# Altium project ball_dropper_rev2.PrjPcb
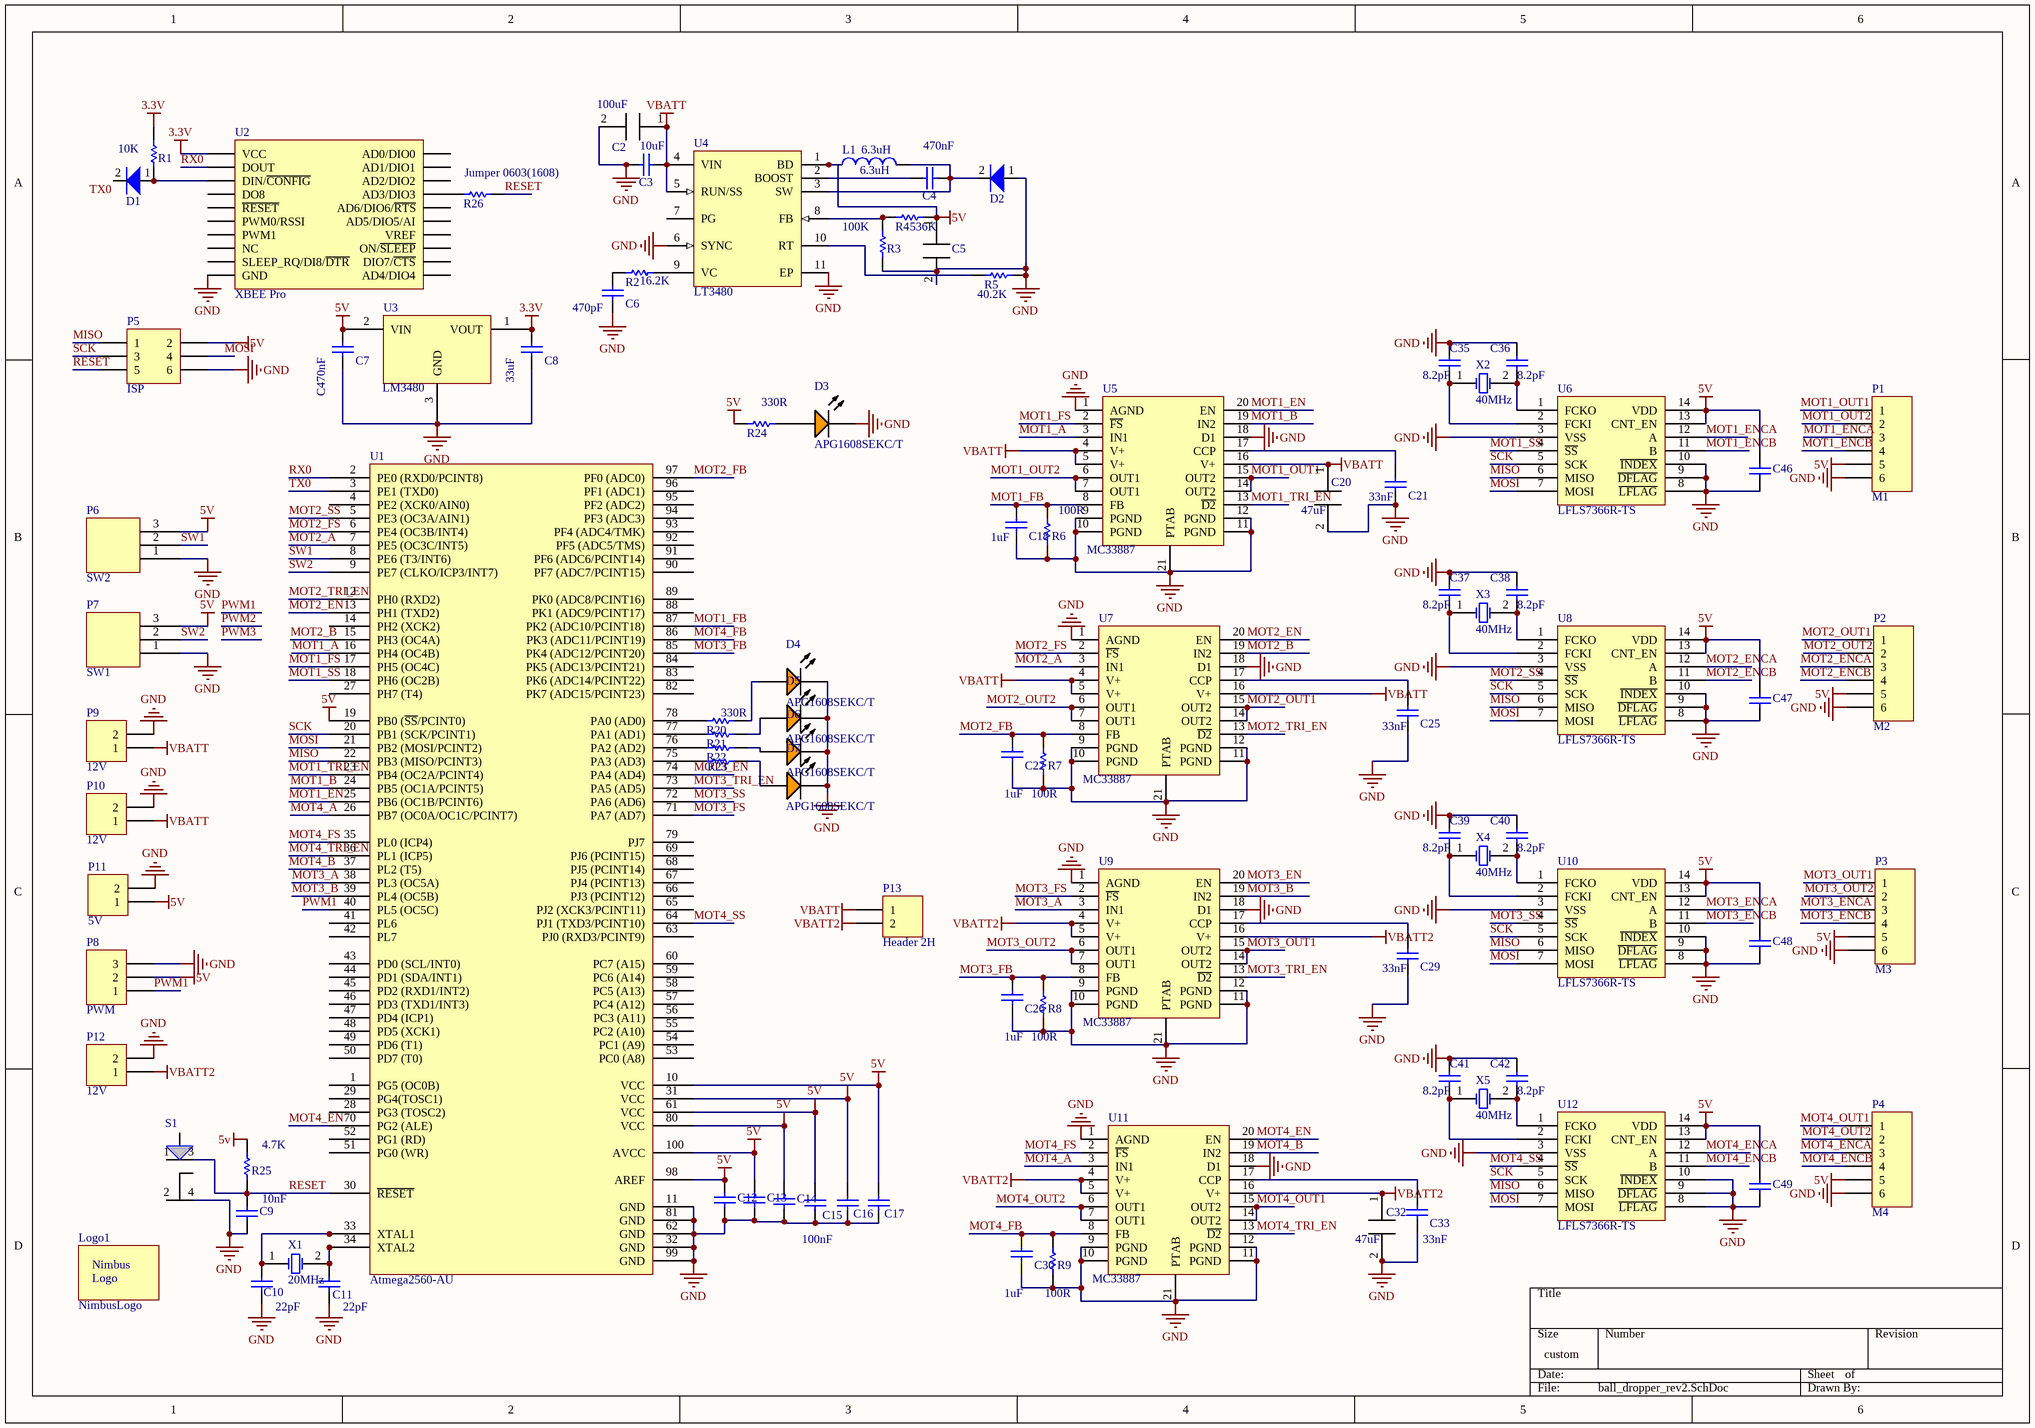
[diagram p0: ball_dropper_rev2.SchDoc]
1 sheet, 94 parts. Net scope: global (net labels, ports and power ports of the same name join across sheets).
Board file: ball_dropper_rev2.PcbDoc

## Sheet ball_dropper_rev2.SchDoc: Fire Ball Dropper Control Board Rev2
size 381 x 266 mm; Date: 11/7/14

### Parts
C2  100uF  [TantalumCap7343]
C3  10uF  [CAPC0603(1608)100_M]
C4  470nF  [CAPC0603(1608)100_N]
C5  47uF  [TantalumCap7343]  (value not drawn)
C6  470pF  [CAPC0603(1608)100_N]
C7  C470nF  [CAPC0603(1608)100_N]
C8  33uF  [CAPC1206(3216)190_M]
C9  10nF  [CAPC0603(1608)100_M]
C10  22pF  [CAPC0603(1608)100_M]
C11  22pF  [CAPC0603(1608)100_M]
C12  100nF  [CAPC0603(1608)100_N]  (value not drawn)
C13  100nF  [CAPC0603(1608)100_N]  (value not drawn)
C14  100nF  [CAPC0603(1608)100_N]  (value not drawn)
C15  100nF  [CAPC0603(1608)100_N]  (value not drawn)
C16  100nF  [CAPC0603(1608)100_N]  (value not drawn)
C17  100nF  [CAPC0603(1608)100_N]
C18  1uF  [CAPC0603(1608)100_N]
C20  47uF  [TantalumCap7343]
C21  33nF  [CAPC0603(1608)100_N]
C22  1uF  [CAPC0603(1608)100_N]
C25  33nF  [CAPC0603(1608)100_N]
C26  1uF  [CAPC0603(1608)100_N]
C29  33nF  [CAPC0603(1608)100_N]
C30  1uF  [CAPC0603(1608)100_N]
C32  47uF  [TantalumCap7343]
C33  33nF  [CAPC0603(1608)100_N]
C35  8.2pF  [CAPC0603(1608)100_N]
C36  8.2pF  [CAPC0603(1608)100_N]
C37  8.2pF  [CAPC0603(1608)100_N]
C38  8.2pF  [CAPC0603(1608)100_N]
C39  8.2pF  [CAPC0603(1608)100_N]
C40  8.2pF  [CAPC0603(1608)100_N]
C41  8.2pF  [CAPC0603(1608)100_N]
C42  8.2pF  [CAPC0603(1608)100_N]
C46  100nF  [CAPC0603(1608)100_N]  (value not drawn)
C47  100nF  [CAPC0603(1608)100_N]  (value not drawn)
C48  100nF  [CAPC0603(1608)100_N]  (value not drawn)
C49  100nF  [CAPC0603(1608)100_N]  (value not drawn)
D1  diode_MBRA210LT3G  [C1206]  (value not drawn)
D2  diode_B340A  [diode_B340A]  (value not drawn)
D3  APG1608SEKC/T  [KING-LED0603-25-ORANGE_V]
D4  APG1608SEKC/T  [KING-LED0603-25-ORANGE_V]
D5  APG1608SEKC/T  [KING-LED0603-25-ORANGE_V]
D6  APG1608SEKC/T  [KING-LED0603-25-ORANGE_V]
D7  APG1608SEKC/T  [KING-LED0603-25-ORANGE_V]
L1  6.3uH  [TYS6045]
Logo1  NimbusLogo  [NIMBUS Logo]
P1  M1  [DF3A-6P-2DS]
P2  M2  [DF3A-6P-2DS]
P3  M3  [DF3A-6P-2DS]
P4  M4  [DF3A-6P-2DS]
P5  ISP  [HDR2X3]
P6  SW2  [DF3A-3P-2DS]
P7  SW1  [DF3A-3P-2DS]
P8  PWM  [HDR1X3]
P9  12V  [DF3A-2P-2DS]
P10  12V  [DF3A-2P-2DS]
P11  5V  [DF3A-2P-2DS]
P12  12V  [DF3A-2P-2DS]
P13  Header 2H  [HDR1X2H]
R1  10K  [RESC0603(1608)_N]
R2  16.2K  [RESC0603(1608)_N]
R3  100K  [RESC0603(1608)_N]
R4  536K  [RESC0603(1608)_M]
R5  40.2K  [RESC0603(1608)_M]
R6  100R  [RESC0603(1608)_N]
R7  100R  [RESC0603(1608)_N]
R8  100R  [RESC0603(1608)_N]
R9  100R  [RESC0603(1608)_N]
R20  330R  [RESC0603(1608)_N]
R21  330R  [RESC0603(1608)_N]  (value not drawn)
R22  330R  [RESC0603(1608)_N]  (value not drawn)
R23  330R  [RESC0603(1608)_N]  (value not drawn)
R24  330R  [RESC0603(1608)_N]
R25  4.7K  [RESC0603(1608)_N]
R26  Jumper 0603(1608)  [RESC0603(1608)_N]
S1  TactileSwitch  [TactileSwitch]  (value not drawn)
U1  Atmega2560-AU  [TSQFP50P1600X1600X160-100N]
U2  XBEE Pro  [XBEE PRO]
U3  LM3480  [LM3480]
U4  LT3480  [LT-MSE-10-EDP_L]
U5  MC33887  [MC33887]
U6  LFLS7366R-TS  [TSOP127P600X135-14N]
U7  MC33887  [MC33887]
U8  LFLS7366R-TS  [TSOP127P600X135-14N]
U9  MC33887  [MC33887]
U10  LFLS7366R-TS  [TSOP127P600X135-14N]
U11  MC33887  [MC33887]
U12  LFLS7366R-TS  [TSOP127P600X135-14N]
X1  20MHz  [xtal4]
X2  40MHz  [xtal4]
X3  40MHz  [xtal4]
X4  40MHz  [xtal4]
X5  40MHz  [xtal4]

### Nets
3.3V: C8.2 R1.2 U2.1(VCC) U3.1(VOUT)
5V: C5.1(VCC) C7.2 C12.2 C13.2 C14.2 C15.1 C16.2 C17.2 C46.2 C47.2 C48.2 C49.2 L1.1 P1.5 P2.5 P3.5 P4.5 P5.2 P6.3 P7.3 P8.2 P11.1 R4.2 R24.1 R25.2 U1.10(VCC) U1.19(PB0_(~{SS}/PCINT0)) U1.31(VCC) U1.61(VCC) U1.80(VCC) U1.98(AREF) U1.100(AVCC) U3.2(VIN) U4.1(BD) U6.13(CNT_EN) U6.14(VDD) U8.13(CNT_EN) U8.14(VDD) U10.13(CNT_EN) U10.14(VDD) U12.13(CNT_EN) U12.14(VDD)
GND: C2.2(GND) C3.1 C5.2(GND) C6.1 C7.1 C8.1 C9.1 C10.1 C11.1 C12.1 C13.1 C14.1 C15.2 C16.1 C17.1 C18.1 C20.2(GND) C21.1 C22.1 C25.1 C26.1 C29.1 C30.1 C32.2(GND) C33.1 C35.2 C36.2 C37.2 C38.2 C39.2 C40.2 C41.2 C42.2 C46.1 C47.1 C48.1 C49.1 D2.1 D3.2(K) D4.2(K) D5.2(K) D6.2(K) D7.2(K) P1.6 P2.6 P3.6 P4.6 P5.6 P6.1 P7.1 P8.3 P9.2 P10.2 P11.2 P12.2 R3.1 R5.2 R6.1 R7.1 R8.1 R9.1 S1.4(GND) U1.11(GND) U1.32(GND) U1.62(GND) U1.81(GND) U1.99(GND) U2.10(GND) U3.3(GND) U4.6(SYNC) U4.11(EP) U5.1(AGND) U5.9(PGND) U5.10(PGND) U5.11(PGND) U5.12(PGND) U5.18(D1) U5.21(PTAB) U6.3(VSS) U6.8(~{LFLAG}) U6.9(~{DFLAG}) U6.10(~{INDEX}) U7.1(AGND) U7.9(PGND) U7.10(PGND) U7.11(PGND) U7.12(PGND) U7.18(D1) U7.21(PTAB) U8.3(VSS) U8.8(~{LFLAG}) U8.9(~{DFLAG}) U8.10(~{INDEX}) U9.1(AGND) U9.9(PGND) U9.10(PGND) U9.11(PGND) U9.12(PGND) U9.18(D1) U9.21(PTAB) U10.3(VSS) U10.8(~{LFLAG}) U10.9(~{DFLAG}) U10.10(~{INDEX}) U11.1(AGND) U11.9(PGND) U11.10(PGND) U11.11(PGND) U11.12(PGND) U11.18(D1) U11.21(PTAB) U12.3(VSS) U12.8(~{LFLAG}) U12.9(~{DFLAG}) U12.10(~{INDEX})
VBATT: C2.1(VCC) C3.2 C20.1(VCC) P9.1 P10.1 P13.1 U4.4(VIN) U4.5(RUN/SS) U5.4(V+) U5.5(V+) U5.16(V+) U7.4(V+) U7.5(V+) U7.16(V+)
VBATT2: C32.1(VCC) P12.1 P13.2 U9.4(V+) U9.5(V+) U9.16(V+) U11.4(V+) U11.5(V+) U11.16(V+)
MISO: P5.1 U1.22(PB3_(MISO/PCINT3)) U6.6(MISO) U8.6(MISO) U10.6(MISO) U12.6(MISO)
MOSI: P5.4 U1.21(PB2_(MOSI/PCINT2)) U6.7(MOSI) U8.7(MOSI) U10.7(MOSI) U12.7(MOSI)
MOT1_A: U1.16(PH4_(OC4B)) U5.3(IN1)
MOT1_B: U1.24(PB5_(OC1A/PCINT5)) U5.19(IN2)
MOT1_EN: U1.25(PB6_(OC1B/PCINT6)) U5.20(EN)
MOT1_ENCA: P1.3 U6.12(A)
MOT1_ENCB: P1.4 U6.11(B)
MOT1_FB: C18.2 R6.2 U1.87(PK2_(ADC10/PCINT18)) U5.8(FB)
MOT1_FS: U1.17(PH5_(OC4C)) U5.2(~{FS})
MOT1_OUT1: P1.1 U5.14(OUT2) U5.15(OUT2)
MOT1_OUT2: P1.2 U5.6(OUT1) U5.7(OUT1)
MOT1_SS: U1.18(PH6_(OC2B)) U6.4(~{SS})
MOT1_TRI_EN: U1.23(PB4_(OC2A/PCINT4)) U5.13(~{D2})
MOT2_A: U1.7(PE5_(OC3C/INT5)) U7.3(IN1)
MOT2_B: U1.15(PH3_(OC4A)) U7.19(IN2)
MOT2_EN: U1.13(PH1_(TXD2)) U7.20(EN)
MOT2_ENCA: P2.3 U8.12(A)
MOT2_ENCB: P2.4 U8.11(B)
MOT2_FB: C22.2 R7.2 U1.97(PF0_(ADC0)) U7.8(FB)
MOT2_FS: U1.6(PE4_(OC3B/INT4)) U7.2(~{FS})
MOT2_OUT1: P2.1 U7.14(OUT2) U7.15(OUT2)
MOT2_OUT2: P2.2 U7.6(OUT1) U7.7(OUT1)
MOT2_SS: U1.5(PE3_(OC3A/AIN1)) U8.4(~{SS})
MOT2_TRI_EN: U1.12(PH0_(RXD2)) U7.13(~{D2})
MOT3_A: U1.38(PL3_(OC5A)) U9.3(IN1)
MOT3_B: U1.39(PL4_(OC5B)) U9.19(IN2)
MOT3_EN: U1.74(PA4_(AD4)) U9.20(EN)
MOT3_ENCA: P3.3 U10.12(A)
MOT3_ENCB: P3.4 U10.11(B)
MOT3_FB: C26.2 R8.2 U1.85(PK4_(ADC12/PCINT20)) U9.8(FB)
MOT3_FS: U1.71(PA7_(AD7)) U9.2(~{FS})
MOT3_OUT1: P3.1 U9.14(OUT2) U9.15(OUT2)
MOT3_OUT2: P3.2 U9.6(OUT1) U9.7(OUT1)
MOT3_SS: U1.72(PA6_(AD6)) U10.4(~{SS})
MOT3_TRI_EN: U1.73(PA5_(AD5)) U9.13(~{D2})
MOT4_A: U1.26(PB7_(OC0A/OC1C/PCINT7)) U11.3(IN1)
MOT4_B: U1.37(PL2_(T5)) U11.19(IN2)
MOT4_EN: U1.70(PG2_(ALE)) U11.20(EN)
MOT4_ENCA: P4.3 U12.12(A)
MOT4_ENCB: P4.4 U12.11(B)
MOT4_FB: C30.2 R9.2 U1.86(PK3_(ADC11/PCINT19)) U11.8(FB)
MOT4_FS: U1.35(PL0_(ICP4)) U11.2(~{FS})
MOT4_OUT1: P4.1 U11.14(OUT2) U11.15(OUT2)
MOT4_OUT2: P4.2 U11.6(OUT1) U11.7(OUT1)
MOT4_SS: U1.64(PJ1_(TXD3/PCINT10)) U12.4(~{SS})
MOT4_TRI_EN: U1.36(PL1_(ICP5)) U11.13(~{D2})
PWM1: P8.1 U1.40(PL5_(OC5C))
RESET: C9.2 P5.5 R25.1 R26.2 S1.3(GND) U1.30(~{RESET})
RX0: U1.2(PE0_(RXD0/PCINT8)) U2.2(DOUT)
SCK: P5.3 U1.20(PB1_(SCK/PCINT1)) U6.5(SCK) U8.5(SCK) U10.5(SCK) U12.5(SCK)
SW1: P6.2 U1.8(PE6_(T3/INT6))
SW2: P7.2 U1.9(PE7_(CLKO/ICP3/INT7))
TX0: D1.2 U1.3(PE1_(TXD0))
NetC4_1: C4.1 U4.2(BOOST)
NetC4_2: C4.2 D2.2 L1.2 U4.3(SW)
NetC6_2: C6.2 R2.1
NetC10_2: C10.2 U1.33(XTAL1) X1.1(OSC1)
NetC11_2: C11.2 U1.34(XTAL2) X1.2(OSC2)
NetC21_2: C21.2 U5.17(CCP)
NetC25_2: C25.2 U7.17(CCP)
NetC29_2: C29.2 U9.17(CCP)
NetC33_2: C33.2 U11.17(CCP)
NetC35_1: C35.1 U6.2(FCKI) X2.1(OSC1)
NetC36_1: C36.1 U6.1(FCKO) X2.2(OSC2)
NetC37_1: C37.1 U8.2(FCKI) X3.1(OSC1)
NetC38_1: C38.1 U8.1(FCKO) X3.2(OSC2)
NetC39_1: C39.1 U10.2(FCKI) X4.1(OSC1)
NetC40_1: C40.1 U10.1(FCKO) X4.2(OSC2)
NetC41_1: C41.1 U12.2(FCKI) X5.1(OSC1)
NetC42_1: C42.1 U12.1(FCKO) X5.2(OSC2)
NetD1_1: D1.1 R1.1 U2.3(DIN/~{CONFIG})
NetD3_1: D3.1(A) R24.2
NetD4_1: D4.1(A) R20.2
NetD5_1: D5.1(A) R21.2
NetD6_1: D6.1(A) R22.2
NetD7_1: D7.1(A) R23.2
NetR2_2: R2.2 U4.9(VC)
NetR3_2: R3.2 R4.1 U4.8(FB)
NetR5_1: R5.1 U4.10(RT)
NetR20_1: R20.1 U1.78(PA0_(AD0))
NetR21_1: R21.1 U1.77(PA1_(AD1))
NetR22_1: R22.1 U1.76(PA2_(AD2))
NetR23_1: R23.1 U1.75(PA3_(AD3))
NetR26_1: R26.1 U2.17(AD3/DIO3)

Not connected (* = marked no-connect by the designer): S1 1(GND) 2(GND); U1 1(PG5_(OC0B)) 4(PE2_(XCK0/AIN0)) 14(PH2_(XCK2)) 27(PH7_(T4)) 28(PG3_(TOSC2)) 29(PG4(TOSC1)) 41(PL6) 42(PL7) 43(PD0_(SCL/INT0)) 44(PD1_(SDA/INT1)) 45(PD2_(RXD1/INT2)) 46(PD3_(TXD1/INT3)) 47(PD4_(ICP1)) 48(PD5_(XCK1)) 49(PD6_(T1)) 50(PD7_(T0)) 51(PG0_(WR)) 52(PG1_(RD)) 53(PC0_(A8)) 54(PC1_(A9)) 55(PC2_(A10)) 56(PC3_(A11)) 57(PC4_(A12)) 58(PC5_(A13)) 59(PC6_(A14)) 60(PC7_(A15)) 63(PJ0_(RXD3/PCINT9)) 65(PJ2_(XCK3/PCINT11)) 66(PJ3_(PCINT12)) 67(PJ4_(PCINT13)) 68(PJ5_(PCINT14)) 69(PJ6_(PCINT15)) 79(PJ7) 82(PK7_(ADC15/PCINT23)) 83(PK6_(ADC14/PCINT22)) 84(PK5_(ADC13/PCINT21)) 88(PK1_(ADC9/PCINT17)) 89(PK0_(ADC8/PCINT16)) 90(PF7_(ADC7/PCINT15)) 91(PF6_(ADC6/PCINT14)) 92(PF5_(ADC5/TMS)) 93(PF4_(ADC4/TMK)) 94(PF3_(ADC3)) 95(PF2_(ADC2)) 96(PF1_(ADC1)); U2 4(DO8) 5(~{RESET}) 6(PWM0/RSSI) 7(PWM1) 8(NC) 9(SLEEP_RQ/DI8/~{DTR}) 11(AD4/DIO4) 12(DIO7/~{CTS}) 13(ON/~{SLEEP}) 14(VREF) 15(AD5/DIO5/AI) 16(AD6/DIO6/~{RTS}) 18(AD2/DIO2) 19(AD1/DIO1) 20(AD0/DIO0); U4 7(PG)

### Notes on the sheet
- (in symbol NimbusLogo) Nimbus; Logo

### Library data of the parts
C2 C5 C20 C32 = TantalumCap7343
  C2: C: 100uF
  C5 C20 C32: C: 47uF
C3 = CMP-1035-02800-1: CAP 10uF 10V ±20% 0603 (1608 Metric) Thickness 1mm SMD; Case-EIA: 0603; Case-Metric: 1608; Tolerance: ±20%; Max Thickness: 1 mm; Rated Voltage: 10 V; Technology: SMT; Value: 10uF
C4 = CMP-1035-02701-1: CAP 470nF 16V ±20% 0603 (1608 Metric) Thickness 1mm SMD; Case-EIA: 0603; Case-Metric: 1608; Rated Voltage: 16 V; Max Thickness: 1 mm; Value: 470nF; Technology: SMT; Tolerance: ±20%
C6 = CMP-1035-01664-1: CAP 470pF 16V ±2% 0603 (1608 Metric) Thickness 1mm SMD; Case-EIA: 0603; Case-Metric: 1608; Rated Voltage: 16 V; Max Thickness: 1 mm; Tolerance: ±2%; Technology: SMT; Value: 470pF
C7 = CMP-1035-02696-1: CAP 470nF 10V ±10% 0603 (1608 Metric) Thickness 1mm SMD; Case-EIA: 0603; Case-Metric: 1608; Tolerance: ±10%; Max Thickness: 1 mm; Value: 470nF; Technology: SMT; Rated Voltage: 10 V
C8 = CMP-1037-04997-1: CAP 33uF 10V ±20% 1206 (3216 Metric) Thickness 1.9mm SMD; Case-EIA: 1206; Case-Metric: 3216; Technology: SMT; Max Thickness: 1.9 mm; Rated Voltage: 10 V; Tolerance: ±20%; Value: 33uF
C9 = CMP-1035-02304-1: CAP 10nF 10V ±2% 0603 (1608 Metric) Thickness 1mm SMD; Case-EIA: 0603; Case-Metric: 1608; Technology: SMT; Tolerance: ±2%; Rated Voltage: 10 V; Value: 10nF; Max Thickness: 1 mm
C10 C11 = CMP-1035-00797-1: CAP 22pF 10V ±0.25pF 0603 (1608 Metric) Thickness 1mm SMD; Case-Metric: 1608; Case-EIA: 0603; Tolerance: ±0.25pF; Max Thickness: 1 mm; Technology: SMT; Value: 22pF; Rated Voltage: 10 V
C12-C17 C46-C49 = CMP-1035-02582-1: CAP 100nF 10V -20% to +80% 0603 (1608 Metric) Thickness 1mm SMD; Case-Metric: 1608; Case-EIA: 0603; Rated Voltage: 10 V; Value: 100nF; Technology: SMT; Max Thickness: 1 mm; Tolerance: -20% to +80%
C18 C22 C26 C30 = CMP-1035-02740-1: CAP 1uF 25V ±10% 0603 (1608 Metric) Thickness 1mm SMD; Case-Metric: 1608; Case-EIA: 0603; Technology: SMT; Tolerance: ±10%; Rated Voltage: 25 V; Max Thickness: 1 mm; Value: 1uF
C21 C25 C29 C33 = CMP-1035-02463-1: CAP 33nF 25V ±5% 0603 (1608 Metric) Thickness 1mm SMD; Case-Metric: 1608; Case-EIA: 0603; Technology: SMT; Value: 33nF; Max Thickness: 1 mm; Rated Voltage: 25 V; Tolerance: ±5%
C35-C42 = CMP-1035-00477-1: CAP 8.2pF 10V ±0.1pF 0603 (1608 Metric) Thickness 1mm SMD; Case-EIA: 0603; Case-Metric: 1608; Tolerance: ±0.1pF; Max Thickness: 1 mm; Value: 8.2pF; Technology: SMT; Rated Voltage: 10 V
D3-D7 = CMP-0239-00002-1: LED, SMT, 0603(1608), 0.25mm Tthickness, Super Bright Orange; Forward Current: 30 mA; Power Dissipation: 75 mW; Reverse Voltage: 5 V; Packing: Reel; PackageDescription: 2-Pin SMT LED, 1.6 x 0.8 mm Body, 0.25mm Thickness; ComponentLink1URL: http://www.kingbrightusa.com/; PackageVersion: Rev. 4A, 12/2011; Storage Temperature: -40 to 85 degC; PartNumber: APG1608SEKC/T; Mounting Technology: Surface Mount; ComponentLink2Description: Datasheet; DatasheetVersion: Rev. 4A, 12/2011; ComponentLink2URL: http://www.kingbrightusa.com/images/catalog/SPEC/APG1608SEKC-T.pdf; PackageReference: LED0603-25-ORANGE; ComponentLink1Description: Manufacturer URL
L1 = Inductor: Code_IEC: 1005; Published: 8-Jun-2000; LatestRevisionDate: 29-May-2009; LatestRevisionNote: IPC-7351 Footprint Added.; PackageReference: 0402-A; Publisher: Altium Limited; PackageDescription: Chip Inductor; Code_JEITA: 0402; Value: 6.3uH
P1-P4 = Header 6: Header, 6-Pin; LatestRevisionDate: 17-Jul-2002; LatestRevisionNote: Re-released for DXP Platform.; Publisher: Altium Limited
P5 = Header 3X2: Header, 3-Pin, Dual row; LatestRevisionDate: 17-Jul-2002; LatestRevisionNote: Re-released for DXP Platform.; Publisher: Altium Limited
P6 P7 = Hirose3
P8 = Header 3: Header, 3-Pin; LatestRevisionDate: 17-Jul-2002; LatestRevisionNote: Re-released for DXP Platform.; Publisher: Altium Limited
P9-P12 = Header 2: Header, 2-Pin; LatestRevisionDate: 17-Jul-2002; LatestRevisionNote: Re-released for DXP Platform.; Publisher: Altium Limited
P13 = Header 2H: Header, 2-Pin, Right Angle; LatestRevisionDate: 17-Jul-2002; LatestRevisionNote: Re-released for DXP Platform.; Publisher: Altium Limited
R1 = CMP-1012-00098-1: 10K 0.1W 5% 0603 (1608 Metric)  SMD; Case-EIA: 0603; Value: 10000.00 Ohm; Case-Metric: 1608; Technology: SMT; Tolerance: 5 %; Power: 0.1 W
R2 = CMP-1012-00645-1: 16K2 0.1W 1% 0603 (1608 Metric)  SMD; Case-EIA: 0603; Value: 16200.00 Ohm; Case-Metric: 1608; Power: 0.1 W; Tolerance: 1 %; Technology: SMT
R3 = CMP-1012-00122-1: 100K 0.1W 5% 0603 (1608 Metric)  SMD; Case-EIA: 0603; Value: 100000.00 Ohm; Case-Metric: 1608; Tolerance: 5 %; Power: 0.1 W; Technology: SMT
R4 = CMP-1012-00819-1: 536K 0.1W 1% 0603 (1608 Metric)  SMD; Case-EIA: 0603; Case-Metric: 1608; Value: 536000.00 Ohm; Tolerance: 1 %; Power: 0.1 W; Technology: SMT
R5 = CMP-1012-00691-1: 40K2 0.1W 1% 0603 (1608 Metric)  SMD; Case-Metric: 1608; Value: 40200.00 Ohm; Case-EIA: 0603; Tolerance: 1 %; Technology: SMT; Power: 0.1 W
R6-R9 = CMP-1012-00050-1: 100R 0.1W 5% 0603 (1608 Metric)  SMD; Case-EIA: 0603; Value: 100.00 Ohm; Case-Metric: 1608; Tolerance: 5 %; Technology: SMT; Power: 0.1 W
R20-R24 = CMP-1012-00062-1: 330R 0.1W 5% 0603 (1608 Metric)  SMD; Value: 330.00 Ohm; Case-EIA: 0603; Case-Metric: 1608; Tolerance: 5 %; Power: 0.1 W; Technology: SMT
R25 = CMP-1012-00090-1: 4K7 0.1W 5% 0603 (1608 Metric)  SMD; Case-Metric: 1608; Value: 4700.00 Ohm; Case-EIA: 0603; Tolerance: 5 %; Technology: SMT; Power: 0.1 W
R26 = CMP-1012-00001-1: Jumper 0603 (1608 Metric); Case-Metric: 1608; Value: 0.00 Ohm; Power: None; Case-EIA: 0603; Technology: SMT; Tolerance: None
U1 = Atmega2560-AU: ATMEGA2560-16AURCT-ND
U2 = Xbee Pro: XBEE/XBEE Pro
U3 = LM3480: LM3480IM3-3.3/NOPBCT-ND
U4 = CMP-0491-01005-1: 2 A, 2.4 MHz Step-Down Switching Regulator with 70 uA Quiescent Current, 10-pin SOP (MSE-10-EDP), -40 to 85 degC, Pb-Free, Tape and Reel; PartNumber: LT3480EMSE#TRPBF; Manufacturer: Linear Technology; Number of Outputs: 1; Over Voltage Protection(V): 60; ComponentLink3Description: Package Specification; PackageVersion: Rev. I, 05/2013; PackageDescription: 10-Pin Plastic MSOP, Exposed Die Pad, Body 3 x 3 mm, Pitch 0.5 mm; ComponentLink1URL: http://www.linear.com/; ComponentLink3URL: http://cds.linear.com/docs/en/packaging/05081664_I_MSE.pdf; ComponentLink1Description: Manufacturer URL; PackageReference: MSE-10; RoHS: TRUE; Packing: Tape and Reel; Mounting Technology: Surface Mount; ComponentLink2Description: Datasheet; ComponentLink2URL: http://cds.linear.com/docs/en/datasheet/3480fe.pdf
U5 U7 U9 U11 = 33887 H Bridge: MC33887APVWR2CT-ND
X1-X5 = xtal4